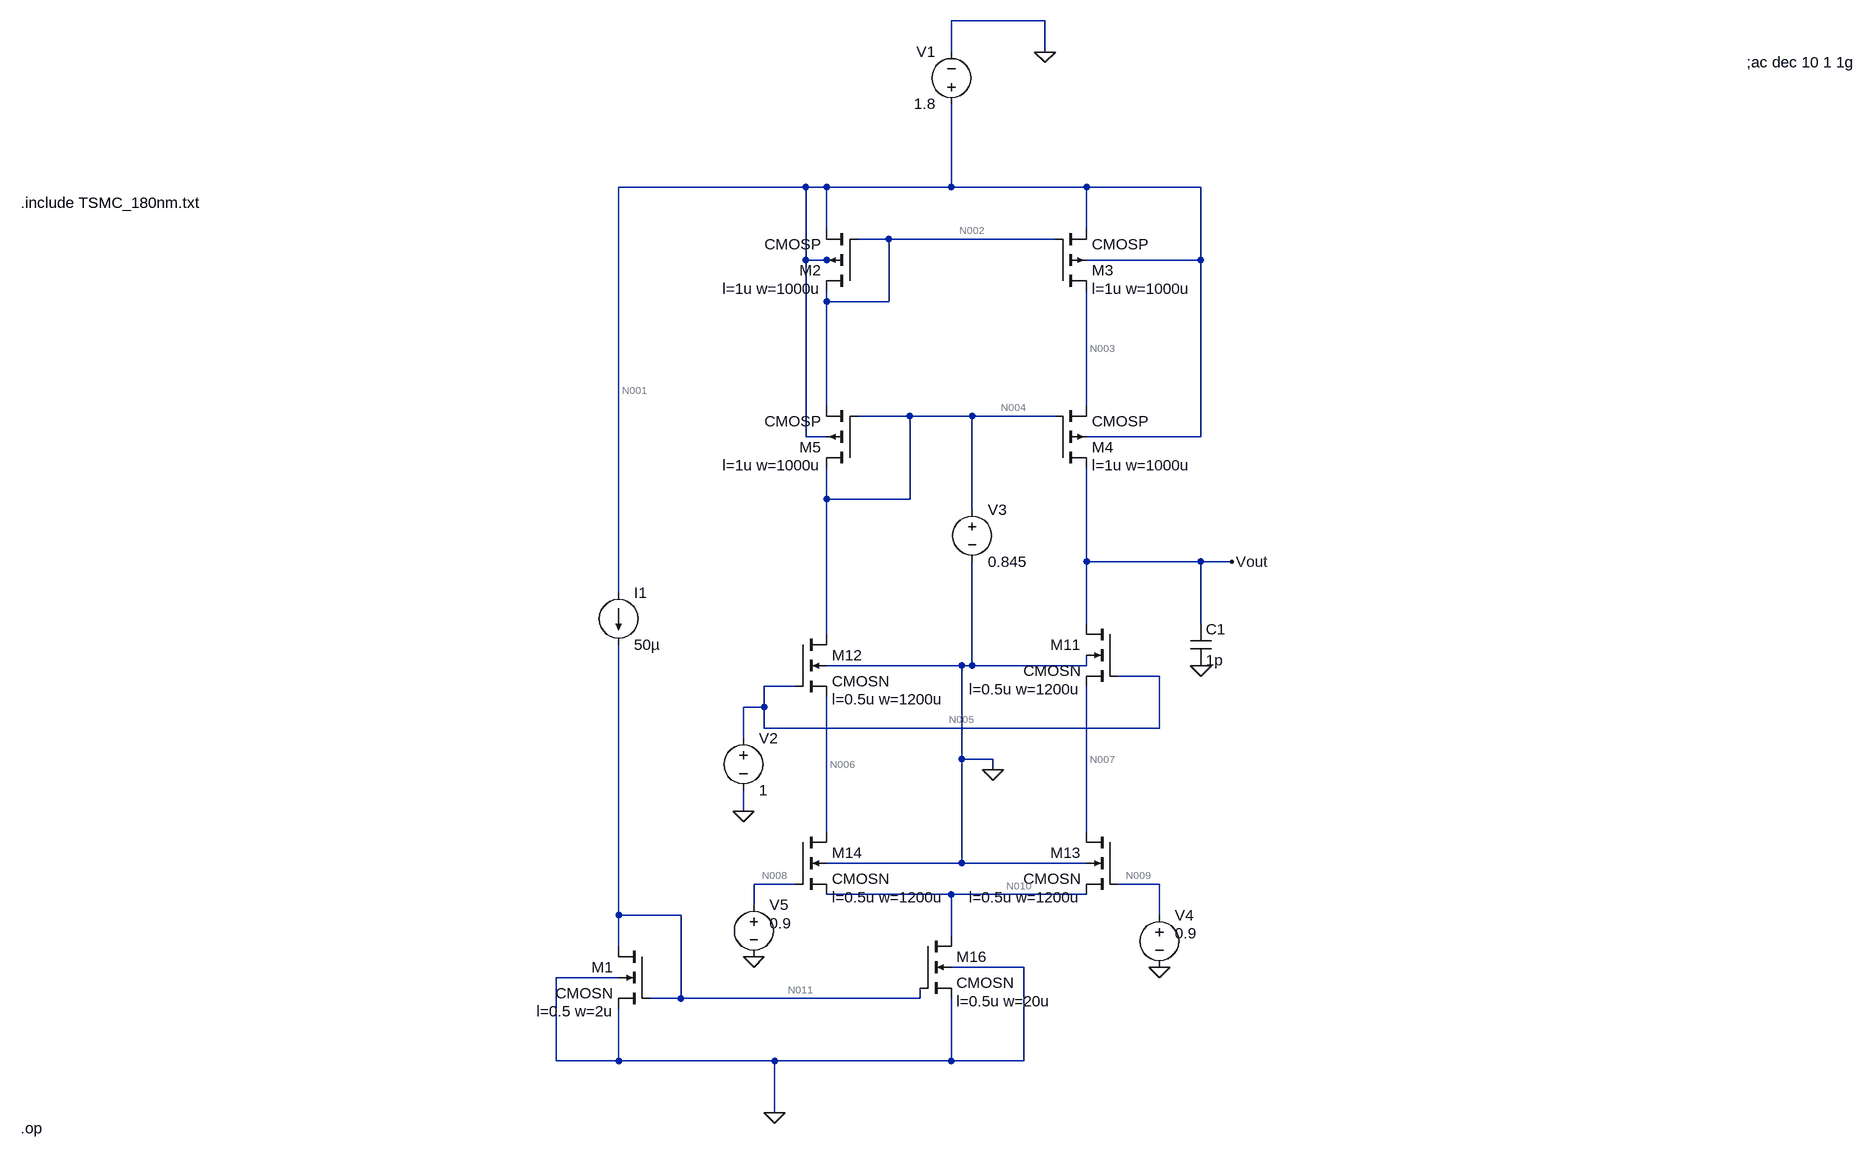
[diagram p0: schematic telescopic.asc]
telescopic.asc, the LTspice schematic file:
Version 4
SHEET 1 2176 776
WIRE 288 -944 144 -944
WIRE 144 -896 144 -944
WIRE 288 -896 288 -944
WIRE -80 -688 -368 -688
WIRE -48 -688 -80 -688
WIRE 144 -688 144 -816
WIRE 144 -688 -48 -688
WIRE 352 -688 144 -688
WIRE 528 -688 352 -688
WIRE -48 -624 -48 -688
WIRE 352 -624 352 -688
WIRE 48 -608 0 -608
WIRE 304 -608 48 -608
WIRE -80 -576 -80 -688
WIRE -48 -576 -80 -576
WIRE -32 -576 -48 -576
WIRE 528 -576 528 -688
WIRE 528 -576 352 -576
WIRE -48 -512 -48 -528
WIRE 48 -512 48 -608
WIRE 48 -512 -48 -512
WIRE -48 -352 -48 -512
WIRE 352 -352 352 -528
WIRE 80 -336 0 -336
WIRE 176 -336 80 -336
WIRE 304 -336 176 -336
WIRE -80 -304 -80 -576
WIRE -48 -304 -80 -304
WIRE 528 -304 528 -576
WIRE 528 -304 352 -304
WIRE -48 -208 -48 -256
WIRE 80 -208 80 -336
WIRE 80 -208 -48 -208
WIRE 176 -192 176 -336
WIRE 352 -112 352 -256
WIRE 528 -112 352 -112
WIRE 576 -112 528 -112
WIRE -368 -64 -368 -688
WIRE 352 -16 352 -112
WIRE 528 -16 528 -112
WIRE -48 0 -48 -208
WIRE 160 48 -48 48
WIRE 176 48 176 -112
WIRE 176 48 160 48
WIRE 352 48 352 32
WIRE 352 48 176 48
WIRE 464 64 400 64
WIRE -96 80 -144 80
WIRE -144 112 -144 80
WIRE -144 112 -176 112
WIRE -144 144 -144 112
WIRE 464 144 464 64
WIRE 464 144 -144 144
WIRE -176 160 -176 112
WIRE 160 192 160 48
WIRE 208 192 160 192
WIRE 208 208 208 192
WIRE -176 272 -176 240
WIRE -48 304 -48 96
WIRE 352 304 352 80
WIRE 160 352 160 192
WIRE 160 352 -48 352
WIRE 352 352 160 352
WIRE -96 384 -160 384
WIRE 464 384 400 384
WIRE 144 400 -48 400
WIRE 352 400 144 400
WIRE -160 416 -160 384
WIRE -368 432 -368 16
WIRE -272 432 -368 432
WIRE 464 432 464 384
WIRE 144 464 144 400
WIRE -368 480 -368 432
WIRE 256 512 144 512
WIRE -368 528 -464 528
WIRE -272 560 -272 432
WIRE -272 560 -320 560
WIRE 96 560 96 544
WIRE 96 560 -272 560
WIRE -464 656 -464 528
WIRE -368 656 -368 576
WIRE -368 656 -464 656
WIRE -128 656 -368 656
WIRE 144 656 144 560
WIRE 144 656 -128 656
WIRE 256 656 256 512
WIRE 256 656 144 656
WIRE -128 736 -128 656
FLAG 288 -896 0
FLAG -128 736 0
FLAG 208 208 0
FLAG -176 272 0
FLAG -160 496 0
FLAG 464 512 0
FLAG 576 -112 Vout
FLAG 528 48 0
DATAFLAG 352 160 ""
DATAFLAG 352 -80 ""
DATAFLAG -48 256 ""
DATAFLAG -48 -96 ""
DATAFLAG 352 -464 ""
DATAFLAG 432 -688 ""
DATAFLAG -48 -432 ""
DATAFLAG -368 368 ""
DATAFLAG 144 432 ""
SYMBOL voltage 144 -800 R180
WINDOW 0 24 96 Left 2
WINDOW 3 24 16 Left 2
WINDOW 123 0 0 Left 0
WINDOW 39 0 0 Left 0
SYMATTR InstName V1
SYMATTR Value 1.8
SYMBOL nmos4 400 -16 M0
WINDOW 123 56 100 Left 2
SYMATTR Value2 l=0.5u w=1200u
SYMATTR InstName M11
SYMATTR Value CMOSN
SYMBOL nmos4 -96 0 R0
WINDOW 123 56 100 Left 2
SYMATTR Value2 l=0.5u w=1200u
SYMATTR InstName M12
SYMATTR Value CMOSN
SYMBOL nmos4 400 304 M0
WINDOW 123 56 100 Left 2
SYMATTR Value2 l=0.5u w=1200u
SYMATTR InstName M13
SYMATTR Value CMOSN
SYMBOL nmos4 -96 304 R0
WINDOW 123 56 100 Left 2
SYMATTR Value2 l=0.5u w=1200u
SYMATTR InstName M14
SYMATTR Value CMOSN
SYMBOL nmos4 96 464 R0
WINDOW 123 56 100 Left 2
SYMATTR Value2 l=0.5u w=20u
SYMATTR InstName M16
SYMATTR Value CMOSN
SYMBOL nmos4 -320 480 M0
WINDOW 123 56 100 Left 2
SYMATTR Value2 l=0.5 w=2u
SYMATTR InstName M1
SYMATTR Value CMOSN
SYMBOL pmos4 0 -528 R180
WINDOW 123 56 4 Left 2
SYMATTR Value2 l=1u w=1000u
SYMATTR InstName M2
SYMATTR Value CMOSP
SYMBOL pmos4 304 -528 M180
WINDOW 123 56 4 Left 2
SYMATTR Value2 l=1u w=1000u
SYMATTR InstName M3
SYMATTR Value CMOSP
SYMBOL pmos4 304 -256 M180
WINDOW 123 56 4 Left 2
SYMATTR Value2 l=1u w=1000u
SYMATTR InstName M4
SYMATTR Value CMOSP
SYMBOL pmos4 0 -256 R180
WINDOW 123 56 4 Left 2
SYMATTR Value2 l=1u w=1000u
SYMATTR InstName M5
SYMATTR Value CMOSP
SYMBOL voltage -176 144 R0
WINDOW 123 0 0 Left 0
WINDOW 39 0 0 Left 0
SYMATTR InstName V2
SYMATTR Value 1
SYMBOL voltage 176 -208 R0
WINDOW 123 0 0 Left 0
WINDOW 39 0 0 Left 0
SYMATTR InstName V3
SYMATTR Value 0.845
SYMBOL voltage 464 416 R0
WINDOW 3 24 44 Left 2
WINDOW 123 24 124 Left 2
WINDOW 39 0 0 Left 0
SYMATTR Value 0.9
SYMATTR InstName V4
SYMBOL cap 512 -16 R0
SYMATTR InstName C1
SYMATTR Value 1p
SYMBOL voltage -160 400 R0
WINDOW 123 24 124 Left 2
WINDOW 39 0 0 Left 0
WINDOW 3 24 44 Left 2
SYMATTR Value 0.9
SYMATTR InstName V5
SYMBOL current -368 -64 R0
WINDOW 123 0 0 Left 0
WINDOW 39 0 0 Left 0
SYMATTR InstName I1
SYMATTR Value 50µ
TEXT -1288 -664 Left 2 !.include TSMC_180nm.txt
TEXT -1288 760 Left 2 !.op
TEXT 1368 -880 Left 2 !;ac dec 10 1 1g

The netlist it stands for:
* telescopic.asc
V1 N001 0 1.8
M11 Vout N005 N007 0 CMOSN l=0.5u w=1200u
M12 N004 N005 N006 0 CMOSN l=0.5u w=1200u
M13 N007 N009 N010 0 CMOSN l=0.5u w=1200u
M14 N006 N008 N010 0 CMOSN l=0.5u w=1200u
M16 N010 N011 0 0 CMOSN l=0.5u w=20u
M1 N011 N011 0 0 CMOSN l=0.5 w=2u
M2 N002 N002 N001 N001 CMOSP l=1u w=1000u
M3 N003 N002 N001 N001 CMOSP l=1u w=1000u
M4 Vout N004 N003 N001 CMOSP l=1u w=1000u
M5 N004 N004 N002 N001 CMOSP l=1u w=1000u
V2 N005 0 1
V3 N004 0 0.845
V4 N009 0 0.9
C1 Vout 0 1p
V5 N008 0 0.9
I1 N001 N011 50µ
.model NMOS NMOS
.model PMOS PMOS
.lib standard.mos
.include TSMC_180nm.txt
.op
;ac dec 10 1 1g
.backanno
.end

* Results of the author's LTspice run, read from the files saved beside the schematic
* Operating Point:
*   V(n001) = 1.8 V
*   V(vout) = 1.8 V
*   V(n005) = 1 V
*   V(n007) = 935.2 mV
*   V(n004) = 845 mV
*   V(n006) = 845.2 mV
*   V(n009) = 900 mV
*   V(n010) = 854.6 mV
*   V(n008) = 900 mV
*   V(n011) = 50 MV
*   V(n002) = 1.384 V
*   V(n003) = 1.8 V
*   Id(M5) = -49 µA
*   Ig(M5) = 0 A
*   Ib(M5) = 1.391 pA
*   Is(M5) = 49 µA
*   Id(M4) = -9.78 pA
*   Ig(M4) = 0 A
*   Ib(M4) = 0 A
*   Is(M4) = 9.78 pA
*   Id(M3) = -9.78 pA
*   Ig(M3) = 0 A
*   Ib(M3) = 0 A
*   Is(M3) = 9.78 pA
*   Id(M2) = -49 µA
*   Ig(M2) = 0 A
*   Ib(M2) = 426.2 fA
*   Is(M2) = 49 µA
*   Id(M1) = 50 µA
*   Ig(M1) = 0 A
*   Ib(M1) = -50 µA
*   Is(M1) = -35.89 pA
*   Id(M16) = 1.538 pA
*   Ig(M16) = 0 A
*   Ib(M16) = -864.6 fA
*   Is(M16) = -672.9 fA
*   Id(M14) = -1.958 pA
*   Ig(M14) = 0 A
*   Ib(M14) = -1.72 pA
*   Is(M14) = 3.677 pA
*   Id(M13) = 7.025 pA
*   Ig(M13) = 0 A
*   Ib(M13) = -1.81 pA
*   Is(M13) = -5.215 pA
*   Id(M12) = -247.4 fA
*   Ig(M12) = 0 A
*   Ib(M12) = -1.71 pA
*   Is(M12) = 1.958 pA
*   Id(M11) = 9.78 pA
*   Ig(M11) = 0 A
*   Ib(M11) = -2.755 pA
*   Is(M11) = -7.025 pA
*   I(C1) = 0 A
*   I(I1) = 50 µA
*   I(V5) = 0 A
*   I(V4) = 0 A
*   I(V3) = 49 µA
*   I(V2) = 0 A
*   I(V1) = -99 µA
* From the log:
*   Semiconductor Device Operating Points:
*                           --- BSIM3 MOSFETS ---
*   Name:        m5          m4          m3          m2          m1
*   Model:      cmosp       cmosp       cmosp       cmosp       cmosn
*   Id:       -4.90e-05   -9.78e-12   -9.78e-12   -4.90e-05    5.00e-05
*   Vgs:      -5.39e-01   -9.55e-01   -4.16e-01   -4.16e-01    5.00e+07
*   Vds:      -5.39e-01   -2.78e-10   -6.48e-09   -4.16e-01    5.00e+07
*   Vbs:       4.16e-01    6.48e-09    0.00e+00    0.00e+00    0.00e+00
*   Vth:      -5.52e-01   -4.28e-01   -4.28e-01   -4.28e-01    3.82e-01
*   Vdsat:    -5.45e-02   -4.12e-01   -5.16e-02   -5.16e-02    1.00e+09
*   Gm:        1.08e-03    1.65e-11    1.70e-10    1.06e-03   -6.99e-19
*   Gds:       5.86e-06    3.51e-02    1.51e-03    6.49e-06    6.99e-19
*   Gmb        2.99e-04    7.07e-12    5.58e-11    3.39e-04   -6.73e-16
*   Cbd:       0.00e+00    0.00e+00    0.00e+00    0.00e+00    0.00e+00
*   Cbs:       0.00e+00    0.00e+00    0.00e+00    0.00e+00    0.00e+00
*   Cgsov:     6.32e-13    6.32e-13    6.32e-13    6.32e-13    1.41e-15
*   Cgdov:     6.32e-13    6.32e-13    6.32e-13    6.32e-13    1.41e-15
*   Cgbov:     9.39e-19    9.39e-19    9.39e-19    9.39e-19    5.00e-13
*   dQgdVgb:   4.82e-12    9.21e-12    5.71e-12    5.10e-12    6.61e-09
*   dQgdVdb:  -6.32e-13   -4.33e-12   -2.07e-12   -6.33e-13   -1.41e-15
*   dQgdVsb:  -3.19e-12   -5.07e-12   -2.67e-12   -3.29e-12   -1.88e-02
*   dQddVgb:  -1.72e-12   -4.59e-12   -2.31e-12   -1.75e-12   -2.81e-09
*   dQddVdb:   6.32e-13    4.00e-12    1.94e-12    6.33e-13    1.41e-15
*   dQddVsb:   1.39e-12    1.88e-12    9.36e-13    1.50e-12    3.69e-09
*   dQbdVgb:  -1.39e-12   -3.10e-14   -1.09e-12   -1.59e-12   -9.97e-10
*   dQbdVdb:  -1.92e-16   -3.03e-12   -1.18e-12   -4.79e-16   -1.42e-26
*   dQbdVsb:  -2.21e-13    6.78e-13    1.62e-13   -3.41e-13    1.88e-02
*   Name:        m16         m14         m13         m12         m11
*   Model:      cmosn       cmosn       cmosn       cmosn       cmosn
*   Id:        1.54e-12   -1.96e-12    7.02e-12   -2.47e-13    9.78e-12
*   Vgs:       5.00e+07    4.54e-02    4.54e-02    1.55e-01    6.48e-02
*   Vds:       8.55e-01   -9.44e-03    8.06e-02   -1.69e-04    8.65e-01
*   Vbs:       0.00e+00   -8.55e-01   -8.55e-01   -8.45e-01   -9.35e-01
*   Vth:       4.64e-01    6.90e-01    6.91e-01    6.90e-01    7.03e-01
*   Vdsat:     1.00e+09    4.07e-02    4.07e-02    4.07e-02    4.10e-02
*   Gm:       -1.35e-20    8.29e-11    1.79e-10    3.25e-11    2.36e-10
*   Gds:       7.87e-13    2.56e-10    8.84e-12    6.49e-09    2.58e-12
*   Gmb        1.11e-20    2.16e-11    4.62e-11    8.24e-12    5.92e-11
*   Cbd:       0.00e+00    0.00e+00    0.00e+00    0.00e+00    0.00e+00
*   Cbs:       0.00e+00    0.00e+00    0.00e+00    0.00e+00    0.00e+00
*   Cgsov:     1.42e-14    8.50e-13    8.50e-13    8.50e-13    8.50e-13
*   Cgdov:     1.42e-14    8.50e-13    8.50e-13    8.50e-13    8.50e-13
*   Cgbov:     4.69e-19    4.69e-19    4.69e-19    4.69e-19    4.69e-19
*   dQgdVgb:   1.07e-13    2.71e-12    2.71e-12    2.69e-12    2.69e-12
*   dQgdVdb:  -5.32e-14   -8.50e-13   -8.50e-13   -8.50e-13   -8.50e-13
*   dQgdVsb:  -5.38e-14   -8.50e-13   -8.50e-13   -8.50e-13   -8.50e-13
*   dQddVgb:  -5.36e-14   -8.50e-13   -8.50e-13   -8.50e-13   -8.50e-13
*   dQddVdb:   5.26e-14    8.50e-13    8.50e-13    8.50e-13    8.50e-13
*   dQddVsb:   6.14e-15    1.32e-20    1.09e-20    1.47e-19    1.20e-20
*   dQbdVgb:  -4.69e-19   -1.01e-12   -1.01e-12   -9.86e-13   -9.86e-13
*   dQbdVdb:  -3.79e-14   -5.06e-21   -1.32e-22   -2.40e-19    1.33e-23
*   dQbdVsb:   2.73e-14    3.57e-17    3.58e-17    3.49e-17    3.50e-17